# Altium schematic sheet 50_Distance.SchDoc
size A3; SheetNumber: 6; SheetTotal: 12
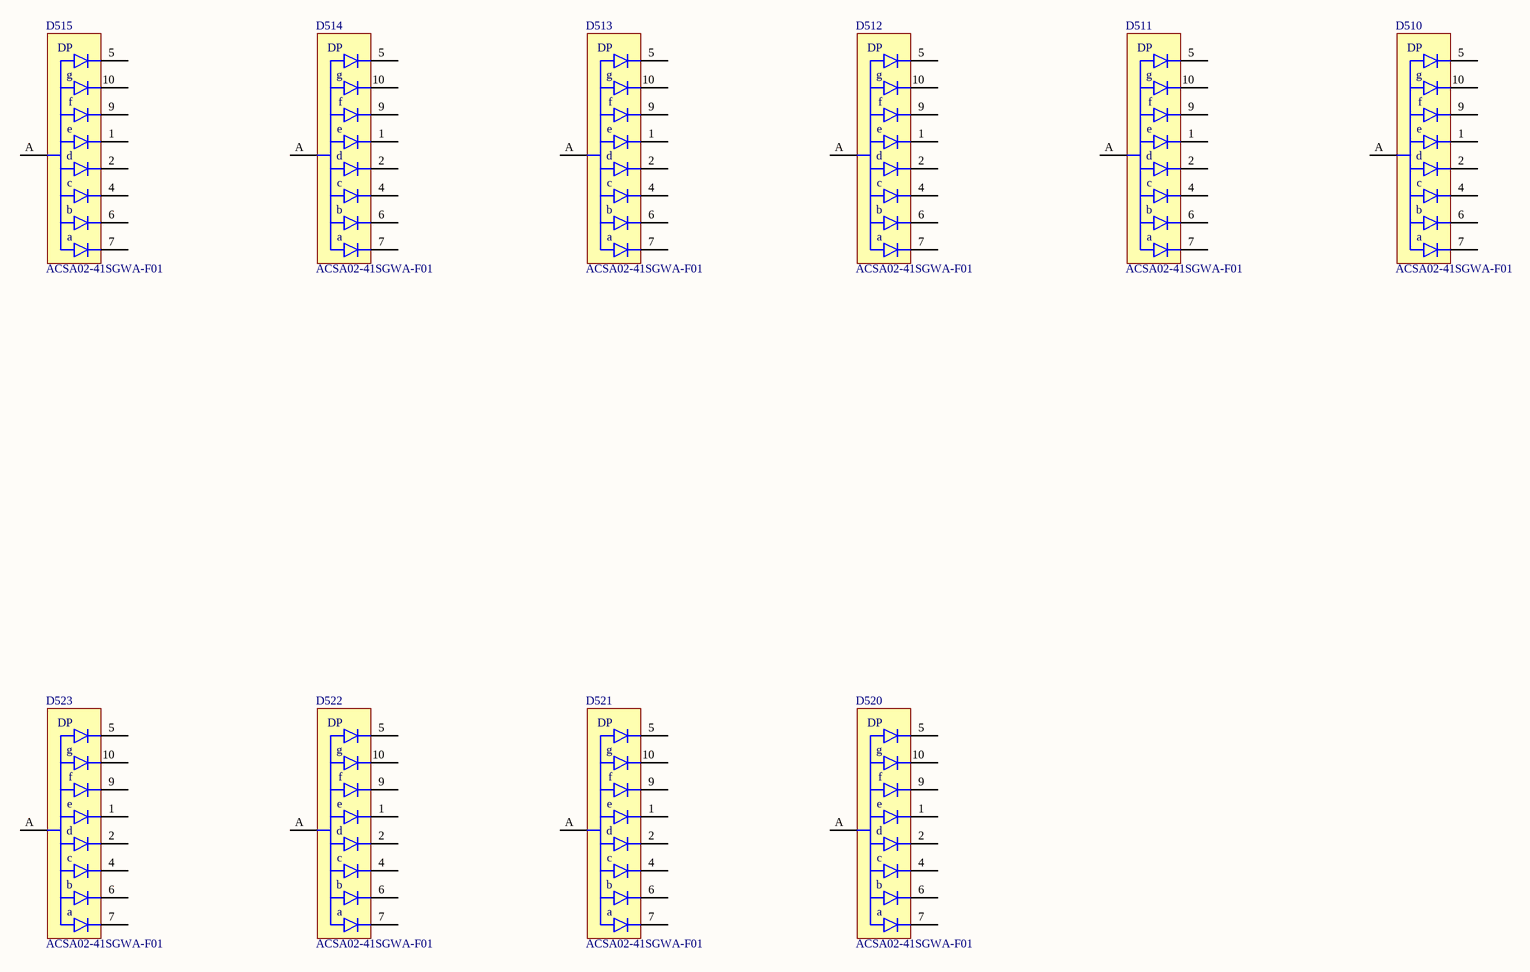
[diagram p0: 50_Distance.SchDoc]

## Parts
D510  ACSA02-41SGWA-F01  [ACSA02-41SGWA-F01]
D511  ACSA02-41SGWA-F01  [ACSA02-41SGWA-F01]
D512  ACSA02-41SGWA-F01  [ACSA02-41SGWA-F01]
D513  ACSA02-41SGWA-F01  [ACSA02-41SGWA-F01]
D514  ACSA02-41SGWA-F01  [ACSA02-41SGWA-F01]
D515  ACSA02-41SGWA-F01  [ACSA02-41SGWA-F01]
D520  ACSA02-41SGWA-F01  [ACSA02-41SGWA-F01]
D521  ACSA02-41SGWA-F01  [ACSA02-41SGWA-F01]
D522  ACSA02-41SGWA-F01  [ACSA02-41SGWA-F01]
D523  ACSA02-41SGWA-F01  [ACSA02-41SGWA-F01]

## Nets

Not connected (* = marked no-connect by the designer): D510 1 2 4 5 6 7 9 10 A; D511 1 2 4 5 6 7 9 10 A; D512 1 2 4 5 6 7 9 10 A; D513 1 2 4 5 6 7 9 10 A; D514 1 2 4 5 6 7 9 10 A; D515 1 2 4 5 6 7 9 10 A; D520 1 2 4 5 6 7 9 10 A; D521 1 2 4 5 6 7 9 10 A; D522 1 2 4 5 6 7 9 10 A; D523 1 2 4 5 6 7 9 10 A

## Notes on the sheet
- (in symbol ACSA02-41SGWA-F01) DP; g; f; e; d; c; b; a